# Altium schematic sheet MotorCell_noPow.SchDoc
size A3; SheetNumber: 3
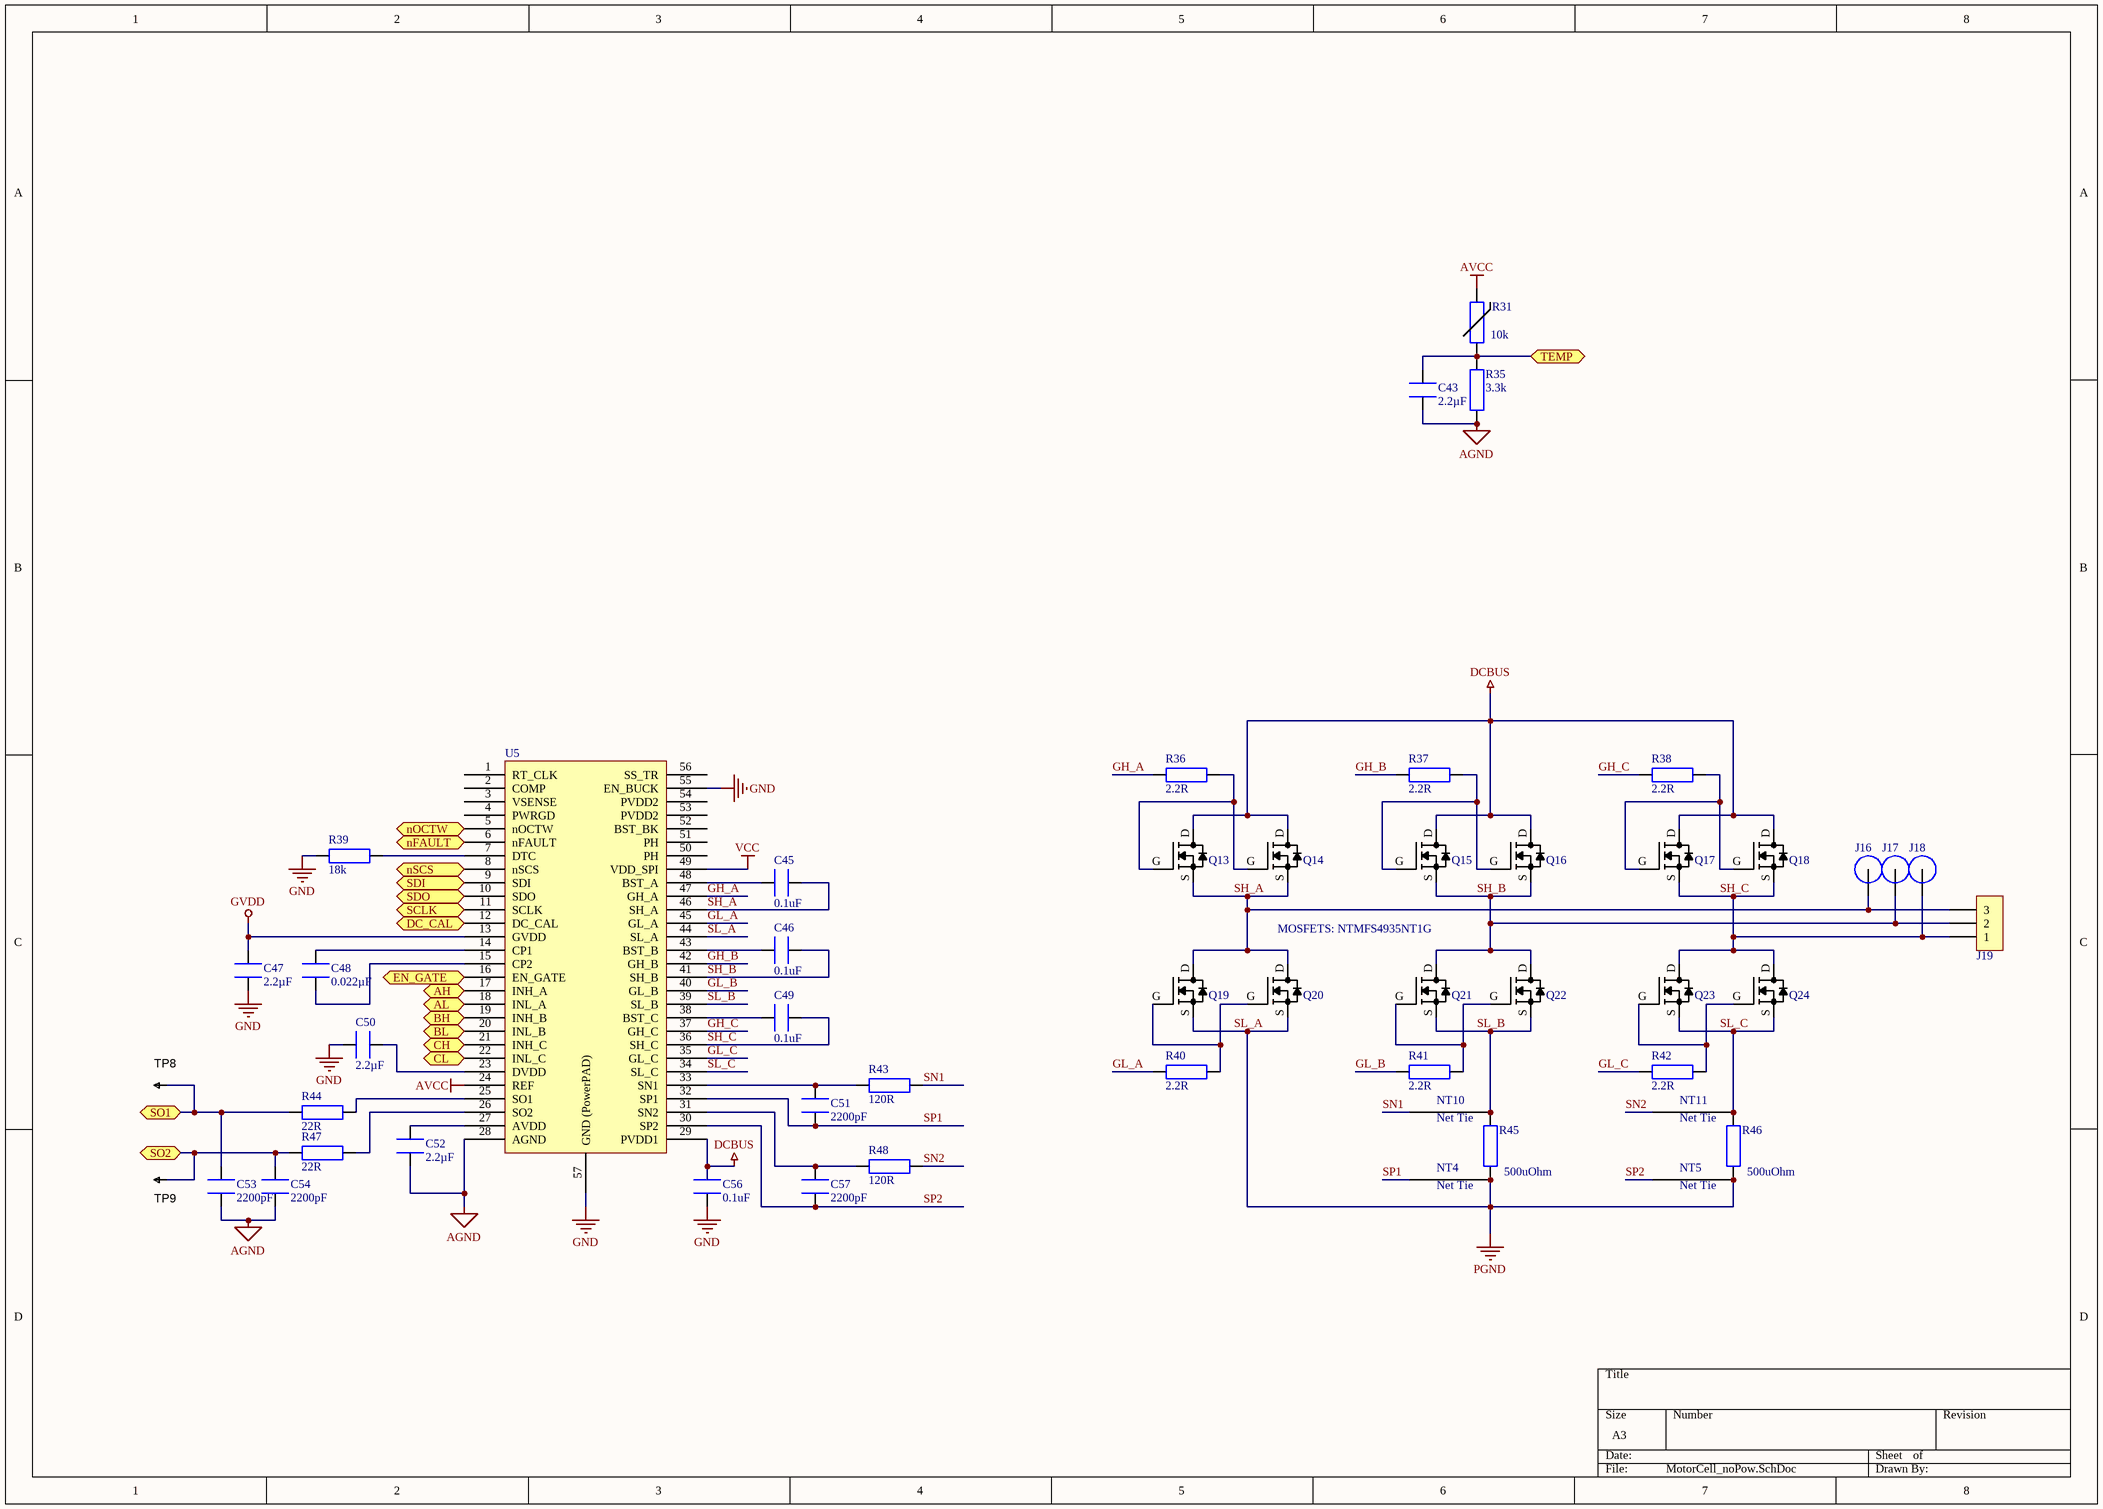
[diagram p0: MotorCell_noPow.SchDoc]

## Parts
C43  2.2µF  [CAPC1608X09L]
C45  0.1uF  [CAPC1608X09L]
C46  0.1uF  [CAPC1608X09L]
C47  2.2µF  [CAPC1608X09L]
C48  0.022µF  [CAPC1608X09L]
C49  0.1uF  [CAPC1608X09L]
C50  2.2µF  [CAPC1608X09L]
C51  2200pF  [CAPC1608X09L]
C52  2.2µF  [CAPC1608X09L]
C53  2200pF  [CAPC1608X09L]
C54  2200pF  [CAPC1608X09L]
C56  0.1uF  [CAPC1608X09L]
C57  2200pF  [CAPC1608X09L]
J16  (no value)  [M3 Spade Hole]
J17  (no value)  [M3 Spade Hole]
J18  (no value)  [M3 Spade Hole]
J19  1704936  [1704936]  (value not drawn)
NT4  0.25mm  [NetTie_0.25mm]  (value not drawn)  (net tie, no BOM)
NT5  0.25mm  [NetTie_0.25mm]  (value not drawn)  (net tie, no BOM)
NT10  0.25mm  [NetTie_0.25mm]  (value not drawn)  (net tie, no BOM)
NT11  0.25mm  [NetTie_0.25mm]  (value not drawn)  (net tie, no BOM)
Q13  (no value)  [SO8FL]
Q14  FILL_FOOTPRINT  [SO8FL_FILL]  (value not drawn)
Q15  (no value)  [SO8FL]
Q16  FILL_FOOTPRINT  [SO8FL_FILL]  (value not drawn)
Q17  (no value)  [SO8FL]
Q18  FILL_FOOTPRINT  [SO8FL_FILL]  (value not drawn)
Q19  (no value)  [SO8FL]
Q20  (no value)  [SO8FL]
Q21  (no value)  [SO8FL]
Q22  (no value)  [SO8FL]
Q23  (no value)  [SO8FL]
Q24  (no value)  [SO8FL]
R31  10k  [RESC1005X40N]
R35  3.3k  [RESC1608X55N]
R36  2.2R  [RESC1608X55N]
R37  2.2R  [RESC1608X55N]
R38  2.2R  [RESC1608X55N]
R39  18k  [RESC1608X55N]
R40  2.2R  [RESC1608X55N]
R41  2.2R  [RESC1608X55N]
R42  2.2R  [RESC1608X55N]
R43  120R  [RESC1608X55N]
R44  22R  [RESC1608X55N]
R45  500uOhm  [RESC6432X09N]
R46  500uOhm  [RESC6432X09N]
R47  22R  [RESC1608X55N]
R48  120R  [RESC1608X55N]
TP8  TESTPOINT  [TP-R30]  (value not drawn)  (no BOM)
TP9  TESTPOINT  [TP-R30]  (value not drawn)  (no BOM)
U5  (no value)  [TSSOP50P810X120_HS-57N]

## Ports
AH, AL, BH, BL, CH, CL, DC_CAL, EN_GATE, nFAULT, nOCTW, nSCS, SCLK, SDI, SDO, SO1, SO2, TEMP

## Nets
AGND: C43.1 C52.1 C53.2 C54.2 R35.2 U5.28(AGND)
AVCC: R31.2 U5.24(REF)
DCBUS: C56.1 Q13.D Q14.D Q15.D Q16.D Q17.D Q18.D U5.29(PVDD1)
GND: C47.1 C50.1 C56.2 R39.2 U5.55(EN_BUCK) U5.57(GND_(PowerPAD))
GVDD: C47.2 U5.13(GVDD)
SL_A: NT4.2 NT5.2 Q19.S Q20.S R45.1 R46.1 U5.44(SL_A)  [also labelled PGND]
VCC: U5.49(VDD_SPI)
AH: U5.17(INH_A) ; port AH
AL: U5.18(INL_A) ; port AL
BH: U5.19(INH_B) ; port BH
BL: U5.20(INL_B) ; port BL
CH: U5.21(INH_C) ; port CH
CL: U5.22(INL_C) ; port CL
DC_CAL: U5.12(DC_CAL) ; port DC_CAL
EN_GATE: U5.16(EN_GATE) ; port EN_GATE
GH_A: R36.1 U5.47(GH_A)
GH_B: R37.1 U5.42(GH_B)
GH_C: R38.1 U5.37(GH_C)
GL_A: R40.1 U5.45(GL_A)
GL_B: R41.1 U5.40(GL_B)
GL_C: R42.1 U5.35(GL_C)
nFAULT: U5.6(nFAULT) ; port nFAULT
nOCTW: U5.5(nOCTW) ; port nOCTW
nSCS: U5.8(nSCS) ; port nSCS
SCLK: U5.11(SCLK) ; port SCLK
SDI: U5.9(SDI) ; port SDI
SDO: U5.10(SDO) ; port SDO
SH_A: C45.1 J16.1 J19.3 Q13.S Q14.S Q19.D Q20.D U5.46(SH_A)
SH_B: C46.1 J17.1 J19.2 Q15.S Q16.S Q21.D Q22.D U5.41(SH_B)
SH_C: C49.1 J18.1 J19.1 Q17.S Q18.S Q23.D Q24.D U5.36(SH_C)
SL_B: NT10.2 Q21.S Q22.S R45.2 U5.39(SL_B)
SL_C: NT11.2 Q23.S Q24.S R46.2 U5.34(SL_C)
SN1: NT10.1 R43.1
SN2: NT11.1 R48.1
SO1: C53.1 R44.2 TP8.1 ; port SO1
SO2: C54.1 R47.2 TP9.1 ; port SO2
SP1: C51.2 NT4.1 U5.32(SP1)
SP2: C57.2 NT5.1 U5.30(SP2)
TEMP: C43.2 R31.1 R35.1 ; port TEMP
NetC45_2: C45.2 U5.48(BST_A)
NetC46_2: C46.2 U5.43(BST_B)
NetC48_1: C48.1 U5.14(CP1)
NetC48_2: C48.2 U5.15(CP2)
NetC49_2: C49.2 U5.38(BST_C)
NetC50_2: C50.2 U5.23(DVDD)
NetC51_1: C51.1 R43.2 U5.33(SN1)
NetC52_2: C52.2 U5.27(AVDD)
NetC57_1: C57.1 R48.2 U5.31(SN2)
NetQ13_G: Q13.G Q14.G R36.2
NetQ15_G: Q15.G Q16.G R37.2
NetQ17_G: Q17.G Q18.G R38.2
NetQ19_G: Q19.G Q20.G R40.2
NetQ21_G: Q21.G Q22.G R41.2
NetQ23_G: Q23.G Q24.G R42.2
NetR39_1: R39.1 U5.7(DTC)
NetR44_1: R44.1 U5.25(SO1)
NetR47_1: R47.1 U5.26(SO2)

Not connected (* = marked no-connect by the designer): U5 1(RT_CLK) 2(COMP) 3(VSENSE) 4(PWRGD) 50(PH) 51(PH) 52(BST_BK) 53(PVDD2) 54(PVDD2) 56(SS_TR)

## Notes on the sheet
- MOSFETS: NTMFS4935NT1G
- (in symbol NetTie_0.25mm) Net Tie

## Library data of the parts
C43 C47 C50 C52 = GRM188R61C225KE15D: CAP CER 2.2UF 16V X5R 0603; Manufacturer: Murata Electronics North America; Tolerance: ±10%; Supplier 1: Digi-Key; Supplier Part Number 1: 490-3296-1-ND; Manufacturer Part Number: GRM188R61C225KE15D; RoHS: RoHS Compliant; Category: Capacitors; Stock 1: 1255740; Pricing 1: 1=0.12, 10=0.08, 50=0.046, 100=0.038, 250=0.032, 500=0.0268, 1000=0.022 (USD); Packaging: Cut Tape (CT); Capacitance: 2.2µF; Voltage - Rated: 16V; Temperature Coefficient: X5R; Mounting Type: Surface Mount, MLCC; Operating Temperature: -55°C ~ 85°C; Applications: General Purpose; Ratings: -; Package / Case: 0603 (1608 Metric); Size / Dimension: 0.063" L x 0.031" W (1.60mm x 0.80mm); Height - Seated (Max): -; Thickness (Max): 0.035" (0.90mm); Lead Spacing: -; Features: -; Lead Style: -; ComponentLink1URL: http://www.murata.com/~/media/webrenewal/support/library/catalog/products/capacitor/mlcc/c02e.pdf; ComponentLink1Description: http://www.murata.com/~/media/webrenewal/support/library/catalog/products/capacitor/mlcc/c02e.pdf
C45 C46 C49 C56 = GRM188R71H104KA93D: CAP CER 0.1UF 50V X7R 0603; Manufacturer: Murata Electronics North America; Tolerance: ±10%; Supplier 1: Digi-Key; Supplier Part Number 1: 490-1519-2-ND; Manufacturer Part Number: GRM188R71H104KA93D; RoHS: RoHS Compliant; Category: Capacitors; Pricing 1: 4000=0.01822, 8000=0.01663, 12000=0.01584 (USD); Packaging: Tape & Reel (TR); Capacitance: 0.1uF; Voltage - Rated: 50V; Temperature Coefficient: X7R; Mounting Type: Surface Mount, MLCC; Operating Temperature: -55°C ~ 125°C; Applications: General Purpose; Ratings: -; Package / Case: 0603 (1608 Metric); Size / Dimension: 0.063" L x 0.032" W (1.60mm x 0.80mm); Height - Seated (Max): -; Thickness (Max): 0.035" (0.90mm); Lead Spacing: -; Features: -; Lead Style: -; ComponentLink1URL: http://www.murata.com/~/media/webrenewal/support/library/catalog/products/capacitor/mlcc/c02e.ashx?la=en-us; ComponentLink1Description: http://www.murata.com/~/media/webrenewal/support/library/catalog/products/capacitor/mlcc/c02e.ashx?la=en-us; Stock: 19812000; Part Status: Active; Supplier 2: Digi-Key; Supplier Part Number 2: 490-1519-1-ND; Pricing 2: 1=0.12, 10=0.084, 100=0.0396, 500=0.02778, 1000=0.023 (USD)
C48 = GRM188R71H223KA01D: CAP CER 0.022UF 50V X7R 0603; Manufacturer: Murata Electronics North America; Tolerance: ±10%; Supplier 1: Digi-Key; Supplier Part Number 1: 490-1517-2-ND; Manufacturer Part Number: GRM188R71H223KA01D; RoHS: RoHS Compliant; Category: Capacitors; Pricing 1: 4000=0.01518, 8000=0.01386, 12000=0.0132 (USD); Packaging: Tape & Reel (TR); Capacitance: 0.022µF; Voltage - Rated: 50V; Temperature Coefficient: X7R; Mounting Type: Surface Mount, MLCC; Operating Temperature: -55°C ~ 125°C; Applications: General Purpose; Ratings: -; Package / Case: 0603 (1608 Metric); Size / Dimension: 0.063" L x 0.032" W (1.60mm x 0.80mm); Height - Seated (Max): -; Thickness (Max): 0.035" (0.90mm); Lead Spacing: -; Features: -; Lead Style: -; ComponentLink1URL: http://search.murata.co.jp/Ceramy/image/img/A01X/G101/ENG/GRM188R71H223KA01-01.pdf; ComponentLink1Description: http://search.murata.co.jp/Ceramy/image/img/A01X/G101/ENG/GRM188R71H223KA01-01.pdf; Stock: 608000; Part Status: Active; Supplier 2: Digi-Key; Supplier Part Number 2: 490-1517-1-ND; Pricing 2: 1=0.11, 10=0.083, 100=0.0372, 500=0.02656, 1000=0.02087 (USD)
C51 C53 C54 C57 = GRM1885C1H222JA01D: CAP CER 2200PF 50V NP0 0603; Manufacturer: Murata Electronics North America; Tolerance: ±5%; Temperature Coefficient: C0G, NP0; Supplier 1: Digi-Key; Supplier Part Number 1: 490-1459-1-ND; RoHS: RoHS Compliant; Category: Capacitors; Stock 1: 850589; Pricing 1: 1=0.11, 10=0.08, 25=0.058, 50=0.0434, 100=0.0355, 250=0.02972, 500=0.02536, 1000=0.01992 (USD); Packaging: Cut Tape (CT); Capacitance: 2200pF; Voltage - Rated: 50V; Mounting Type: Surface Mount, MLCC; Operating Temperature: -55°C ~ 125°C; Applications: General Purpose; Ratings: -; Package / Case: 0603 (1608 Metric); Size / Dimension: 0.063" L x 0.031" W (1.60mm x 0.80mm); Height - Seated (Max): -; Thickness (Max): 0.035" (0.90mm); Lead Spacing: -; Features: -; Lead Style: -; ComponentLink1URL: http://www.murata.com/~/media/webrenewal/support/library/catalog/products/capacitor/mlcc/c02e.ashx; ComponentLink1Description: http://www.murata.com/~/media/webrenewal/support/library/catalog/products/capacitor/mlcc/c02e.ashx; Part Status: Active
J16-J18 = M3 Spade Terminal
J19 = 1704936: CONN TERM BLOCK 3POS 7.62MM; Manufacturer: Phoenix Contact; Number of Levels: 1; Positions Per Level: 3; Pitch: 0.300" (7.62mm); Mating Orientation: Horizontal with Board; Current: 30A; Voltage: 300V; Wire Gauge: 10-30 AWG; Wire Termination: Screw - Rising Cage Clamp; Torque - Screw: 0.5-0.6 Nm (4.4-5.3 Lb-In); Screw Thread: M3; Supplier 1: Digi-Key; Supplier Part Number 1: 277-5954-ND; RoHS: RoHS Compliant; Category: Connectors, Interconnects; Stock: 3559; Pricing 1: 1=2.19, 10=2.128, 50=1.989, 100=1.8299, 250=1.69064, 500=1.61108, 1000=1.482 (USD); Packaging: Bulk; Part Status: Active; Mounting Type: Through Hole; Features: Interlocking (Side); Color: Green; Operating Temperature: -; Housing Material: Polyamide (PA), Nylon; Contact Material - Plating: -; Clamp Material - Plating: -; Screw Material - Plating: -; ComponentLink1URL: http://media.digikey.com/PDF/Data%20Sheets/Phoenix%20Contact%20PDFs/1704936.pdf; ComponentLink1Description: http://media.digikey.com/PDF/Data%20Sheets/Phoenix%20Contact%20PDFs/1704936.pdf; Manufacturer Part Number: 1704936
NT4 NT5 NT10 NT11 = NetTie_0.25mm
Q13-Q24 = NTMFS4935NT1G: MOSFET N-CH 30V 13A SO8FL; Manufacturer: ON Semiconductor; FET Type: N-Channel; Current - Continuous Drain (Id) @ 25°C: 13A (Ta), 93A (Tc); Drive Voltage (Max Rds On,  Min Rds On): 4.5V, 10V; Vgs(th) (Max) @ Id: 2.2V @ 250µA; Gate Charge (Qg) (Max) @ Vgs: 49.4nC @ 10V; Input Capacitance (Ciss) (Max) @ Vds: 4850pF @ 15V; Vgs (Max): ±20V; Power Dissipation (Max): 930mW (Ta), 48W (Tc); Rds On (Max) @ Id, Vgs: 3.2 mOhm @ 30A, 10V; Supplier 1: Digi-Key; Supplier Part Number 1: NTMFS4935NT1GOSCT-ND; RoHS: RoHS Compliant; Category: Discrete Semiconductor Products; Stock 1: 932; Pricing 1: 1=0.61, 10=0.541, 100=0.4145, 500=0.3277 (USD); Packaging: Cut Tape (CT); Part Status: Active; Technology: MOSFET (Metal Oxide); Drain to Source Voltage (Vdss): 30V; FET Feature: -; Operating Temperature: -55°C ~ 150°C (TJ); Mounting Type: Surface Mount; Supplier Device Package: 5-DFN (5x6) (8-SOFL); Package / Case: 8-PowerTDFN, 5 Leads; ComponentLink1URL: http://www.onsemi.com/pub_link/Collateral/NTMFS4935N-D.PDF; ComponentLink1Description: http://www.onsemi.com/pub_link/Collateral/NTMFS4935N-D.PDF; Manufacturer Part Number: NTMFS4935NT1G
R31 = NCP15XH103F03RC: THERMISTOR 10K OHM NTC 0402 SMD; Value: 10k
R35 = RC0603FR-073K3L: RES SMD 3.3K OHM 1% 1/10W 0603; Manufacturer: Yageo; Power (Watts): 0.1W, 1/10W; Temperature Coefficient: ±100ppm/°C; Supplier 1: Digi-Key; Supplier Part Number 1: 311-3.30KHRCT-ND; Manufacturer Part Number: RC0603FR-073K3L; RoHS: RoHS Compliant; Category: Resistors; Stock 1: 420019; Pricing 1: 1=0.1, 10=0.014, 25=0.01, 100=0.0057, 250=0.00436, 500=0.00348, 1000=0.00257, 2500=0.00223 (USD); Packaging: Cut Tape (CT); Resistance (Ohms): 3.3k; Tolerance: ±1%; Composition: Thick Film; Features: Moisture Resistant; Operating Temperature: -55°C ~ 155°C; Package / Case: 0603 (1608 Metric); Supplier Device Package: 0603; Size / Dimension: 0.063" L x 0.031" W (1.60mm x 0.80mm); Height: 0.022" (0.55mm); Number of Terminations: 2; ComponentLink1URL: http://www.yageo.com/documents/recent/PYu-RC_Group_51_RoHS_L_04.pdf; ComponentLink1Description: http://www.yageo.com/documents/recent/PYu-RC_Group_51_RoHS_L_04.pdf
R36-R38 R40-R42 = RC0603FR-072R2L: RES SMD 2.2 OHM 1% 1/10W 0603; Manufacturer: Yageo; Resistance (Ohms): 2.2; Power (Watts): 0.1W, 1/10W; Temperature Coefficient: ±200ppm/°C; Supplier 1: Digi-Key; Supplier Part Number 1: 311-2.2HRCT-ND; Manufacturer Part Number: RC0603FR-072R2L; RoHS: RoHS Compliant; Category: Resistors; Stock 1: 16531; Pricing 1: 1=0.1, 10=0.02, 25=0.0144, 100=0.0082, 250=0.00624, 500=0.00498, 1000=0.00367, 2500=0.00319 (USD); Packaging: Cut Tape (CT); Tolerance: ±1%; Composition: Thick Film; Features: Moisture Resistant; Operating Temperature: -55°C ~ 155°C; Package / Case: 0603 (1608 Metric); Supplier Device Package: 0603; Size / Dimension: 0.063" L x 0.031" W (1.60mm x 0.80mm); Height: 0.022" (0.55mm); Number of Terminations: 2; ComponentLink1URL: http://www.yageo.com/documents/recent/PYu-RC_Group_51_RoHS_L_04.pdf; ComponentLink1Description: http://www.yageo.com/documents/recent/PYu-RC_Group_51_RoHS_L_04.pdf
R39 = RC0603FR-0718KL: RES SMD 18K OHM 1% 1/10W 0603; Manufacturer: Yageo; Power (Watts): 0.1W, 1/10W; Temperature Coefficient: ±100ppm/°C; Supplier 1: Digi-Key; Supplier Part Number 1: 311-18.0KHRCT-ND; Manufacturer Part Number: RC0603FR-0718KL; RoHS: RoHS Compliant; Category: Resistors; Stock 1: 0; Pricing 1: 1=0.1, 10=0.014, 25=0.01, 100=0.0057, 250=0.00436, 500=0.00348, 1000=0.00257, 2500=0.00223 (USD); Packaging: Cut Tape (CT); Resistance (Ohms): 18k; Tolerance: ±1%; Composition: Thick Film; Features: Moisture Resistant; Operating Temperature: -55°C ~ 155°C; Package / Case: 0603 (1608 Metric); Supplier Device Package: 0603; Size / Dimension: 0.063" L x 0.031" W (1.60mm x 0.80mm); Height: 0.022" (0.55mm); Number of Terminations: 2; ComponentLink1URL: http://www.yageo.com/documents/recent/PYu-RC_Group_51_RoHS_L_04.pdf; ComponentLink1Description: http://www.yageo.com/documents/recent/PYu-RC_Group_51_RoHS_L_04.pdf
R43 R48 = RC0603FR-07120RL: RES SMD 120 OHM 1% 1/10W 0603; Manufacturer: Yageo; Resistance (Ohms): 120; Power (Watts): 0.1W, 1/10W; Temperature Coefficient: ±100ppm/°C; Supplier 1: Digi-Key; Supplier Part Number 1: 311-120HRCT-ND; Manufacturer Part Number: RC0603FR-07120RL; RoHS: RoHS Compliant; Category: Resistors; Stock 1: 1545282; Pricing 1: 1=0.1, 10=0.014, 25=0.01, 100=0.0057, 250=0.00436, 500=0.00348, 1000=0.00257, 2500=0.00223 (USD); Packaging: Cut Tape (CT); Tolerance: ±1%; Composition: Thick Film; Features: Moisture Resistant; Operating Temperature: -55°C ~ 155°C; Package / Case: 0603 (1608 Metric); Supplier Device Package: 0603; Size / Dimension: 0.063" L x 0.031" W (1.60mm x 0.80mm); Height: 0.022" (0.55mm); Number of Terminations: 2; ComponentLink1URL: http://www.yageo.com/documents/recent/PYu-RC_Group_51_RoHS_L_04.pdf; ComponentLink1Description: http://www.yageo.com/documents/recent/PYu-RC_Group_51_RoHS_L_04.pdf
R44 R47 = RC0603FR-0722RL: RES SMD 22 OHM 1% 1/10W 0603; Manufacturer: Yageo; Resistance (Ohms): 22; Power (Watts): 0.1W, 1/10W; Temperature Coefficient: ±100ppm/°C; Supplier 1: Digi-Key; Supplier Part Number 1: 311-22.0HRCT-ND; Manufacturer Part Number: RC0603FR-0722RL; RoHS: RoHS Compliant; Category: Resistors; Stock 1: 575303; Pricing 1: 1=0.1, 10=0.014, 25=0.01, 100=0.0057, 250=0.00436, 500=0.00348, 1000=0.00257, 2500=0.00223 (USD); Packaging: Cut Tape (CT); Tolerance: ±1%; Composition: Thick Film; Features: Moisture Resistant; Operating Temperature: -55°C ~ 155°C; Package / Case: 0603 (1608 Metric); Supplier Device Package: 0603; Size / Dimension: 0.063" L x 0.031" W (1.60mm x 0.80mm); Height: 0.022" (0.55mm); Number of Terminations: 2; ComponentLink1URL: http://www.yageo.com/documents/recent/PYu-RC_Group_51_RoHS_L_04.pdf; ComponentLink1Description: http://www.yageo.com/documents/recent/PYu-RC_Group_51_RoHS_L_04.pdf
R45 R46 = CSR2512C0R0005F: RES SMD 0.0005 OHM 1% 3W 2512; Manufacturer: Riedon; Temperature Coefficient: ±100ppm/°C; Value: 500uOhm; Supplier 1: Digi-Key; Supplier Part Number 1: 696-1183-2-ND; RoHS: RoHS Compliant; Category: Resistors; Stock: 2000; Pricing 1: 2000=0.19817, 6000=0.1937, 10000=0.187, 50000=0.18148 (USD); Packaging: Tape & Reel (TR); Part Status: Active; Tolerance: ±1%; Power (Watts): 3W; Composition: Metal Element; Features: Current Sense; Operating Temperature: -55°C ~ 170°C; Package / Case: 2512 (6432 Metric); Supplier Device Package: 2512; Size / Dimension: 0.250" L x 0.118" W (6.35mm x 3.00mm); Height - Seated (Max): 0.057" (1.45mm); Failure Rate: -; ComponentLink1URL: http://riedon.com/media/pdf/CSR.pdf; ComponentLink1Description: http://riedon.com/media/pdf/CSR.pdf; Supplier 2: Digi-Key; Supplier Part Number 2: 696-1183-1-ND; Pricing 2: 1=0.69, 10=0.574, 25=0.4916, 50=0.4426, 100=0.3852, 250=0.3442, 500=0.27864, 1000=0.22536 (USD); Manufacturer Part Number: CSR2512C0R0005F
TP8 TP9 = TESTPOINT: SMD test pin
U5 = DRV8301: MOTOR DRIVER, 3PH, 56HTSSOP